# EAGLE design tester (EAGLE 5.10)
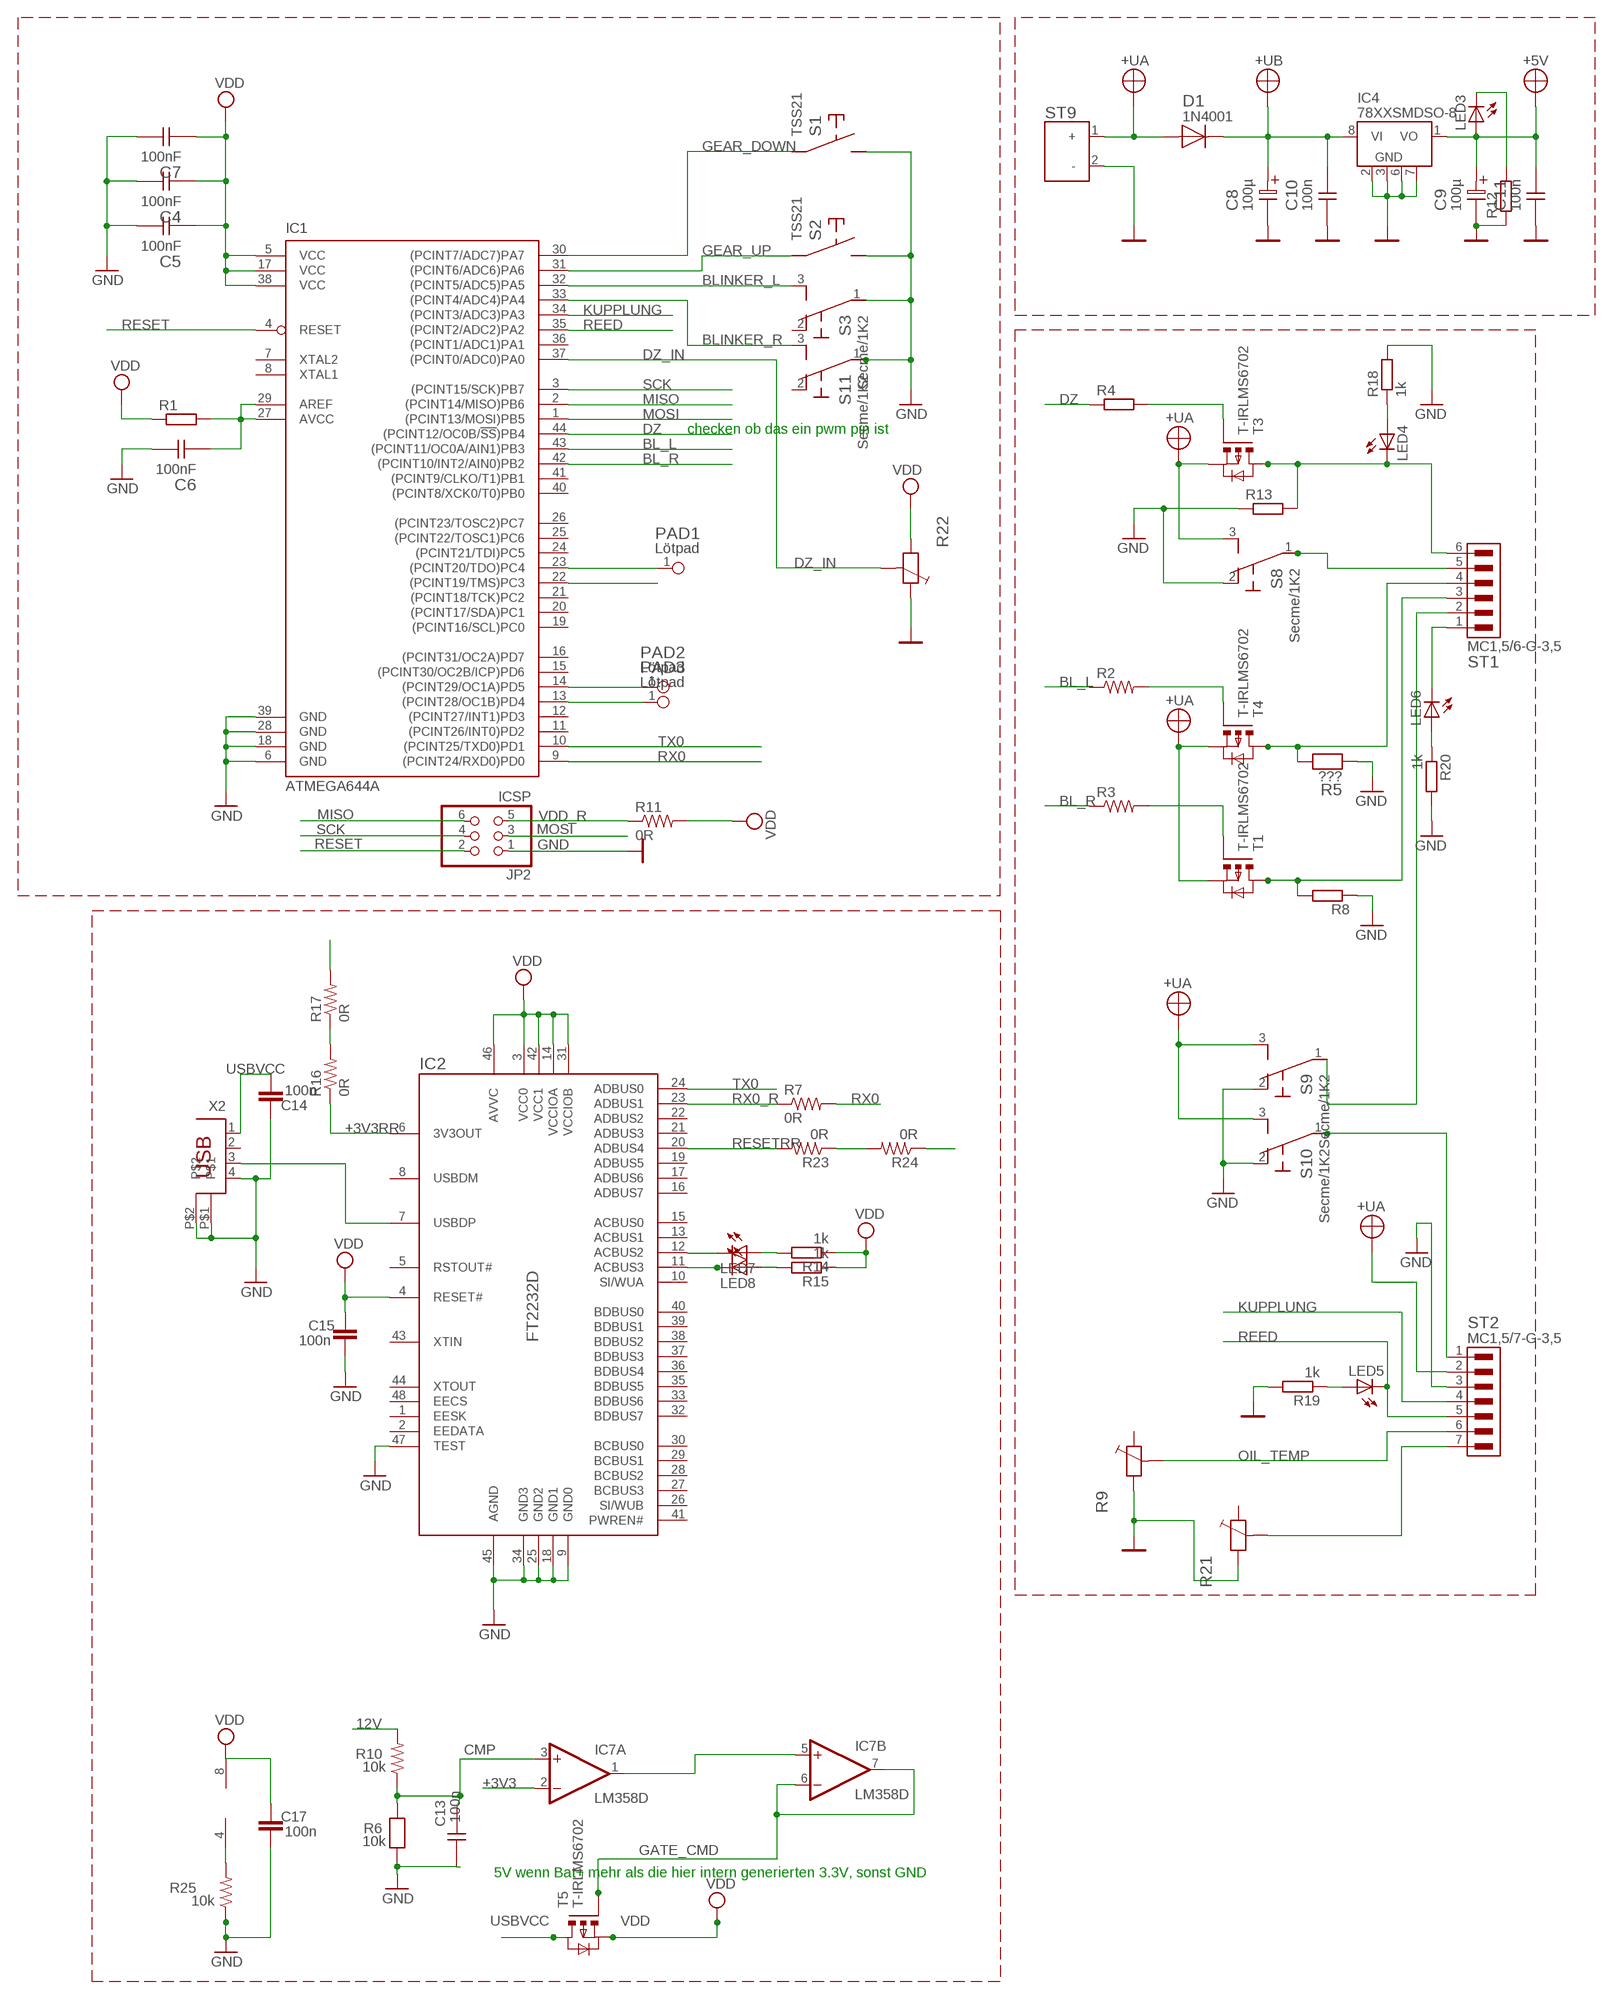
[diagram p0: schematic, sheet 1]

## Parts
C4  100nF  C0805  [0805]
C5  100nF  C0805  [0805]
C6  100nF  C0805  [0805]
C7  100nF  C0805  [0805]
C8  100µ  C-ELKO-SOCD  [CE-SOCD]
C9  100µ  C-ELKO-SOCD  [CE-SOCD]
C10  100n  C0805+0603  [0805+603]
C11  100n  C0805+0603  [0805+603]
C13  100n  WERT_/1206/1206/1206_CHIP-C  [1206]
C14  100n  C-EUC0805  [C0805]
C15  100n  C-EUC0805  [C0805]
C17  100n  C-EUC0805  [C0805]
D1  1N4001  D-MELF  [MELF]
IC1  ATMEGA644A  [TQFP44]
IC2  FT2232D  [LQFP-48]
IC4  78XXSMDSO-8  [SO-8]
IC7  LM358D  [SO08]
JP2  ICSP  PINHD-2X3  [2X03]
LED3  LEDCHIPLED_0805  [CHIPLED_0805]
LED4  LEDCHIPLED_0805  [CHIPLED_0805]
LED5  LEDCHIPLED_0805  [CHIPLED_0805]
LED6  LEDCHIPLED_0805  [CHIPLED_0805]
LED7  LEDCHIPLED_0805  [CHIPLED_0805]
LED8  LEDCHIPLED_0805  [CHIPLED_0805]
PAD1  PAD_01_2X4  [LP_2X4]
PAD2  PAD_01_2X4  [LP_2X4]
PAD3  PAD_01_2X4  [LP_2X4]
R1  R-EU_M0805  [M0805]
R2  RESISTOR1206  [1206]
R3  RESISTOR1206  [1206]
R4  R-EU_M0805  [M0805]
R5  0R  WERT_/0805/0805/0805  [0805]
R6  10k  WERT_/1206/1206/1206  [1206]
R7  0R  RESISTOR1206  [1206]
R8  R-EU_M0805  [M0805]
R9  R-TRIM-10-1,4-B  [PT-10-1,4-B]
R10  10k  RESISTOR1206  [1206]
R11  0R  RESISTOR1206  [1206]
R12  R-EU_M0805  [M0805]
R13  R-EU_M0805  [M0805]
R14  1k  R-EU_M0805  [M0805]
R15  1k  R-EU_M0805  [M0805]
R16  0R  RESISTOR1206  [1206]
R17  0R  RESISTOR1206  [1206]
R18  1k  R-EU_M0805  [M0805]
R19  1k  R-EU_M0805  [M0805]
R20  1k  R-EU_M0805  [M0805]
R21  R-TRIM-10-1,4-B  [PT-10-1,4-B]
R22  R-TRIM-10-1,4-B  [PT-10-1,4-B]
R23  0R  RESISTOR1206  [1206]
R24  0R  RESISTOR1206  [1206]
R25  10k  RESISTOR1206  [1206]
S1  TASTER_TSS21  [SW-KNITTER-TSS21]
S2  TASTER_TSS21  [SW-KNITTER-TSS21]
S3  SCHALTER_1XUM_1K2_1MM-BOHRUNG  [SW-1K2-10]
S8  SCHALTER_1XUM_1K2_1MM-BOHRUNG  [SW-1K2-10]
S9  SCHALTER_1XUM_1K2_1MM-BOHRUNG  [SW-1K2-10]
S10  SCHALTER_1XUM_1K2_1MM-BOHRUNG  [SW-1K2-10]
S11  SCHALTER_1XUM_1K2_1MM-BOHRUNG  [SW-1K2-10]
ST1  ST_06_MC_RM3,5  [MC1,5/6-G-3,5]
ST2  ST_07_MC_RM3,5  [MC1,5/7-G-3,5]
ST9  FRIWO  [FR-2-LP]
T1  T-IRLMS6702  [SOT-23-6]
T3  T-IRLMS6702  [SOT-23-6]
T4  T-IRLMS6702  [SOT-23-6]
T5  T-IRLMS6702  [SOT-23-6]
X2  PN61729  [PN61729]

## Nets
12V: D1.A R10.2 S8.3(NO) S9.3(NO) S10.3(NO) ST2.2 ST9.1(+) T1.4(S) T3.4(S) T4.4(S) ; supply symbol labelled +UA
+3V3 [power]: IC7.2(A:-IN) R17.2
+3V3RR [power]: IC2.6(3V3OUT) R16.1
+UB: C8.1 C10.2 D1.K IC4.8(VI)
BL_L: IC1.43((PCINT11/OC0A/AIN1)PB3) R2.1
BL_R: IC1.42((PCINT10/INT2/AIN0)PB2) R3.1
BLINKER_L: IC1.32((PCINT5/ADC5)PA5) S3.3(NO)
BLINKER_R: IC1.33((PCINT4/ADC4)PA4) S11.3(NO)
CMP: C13.2 IC7.3(A:+IN) R6.2 R10.1
DZ: IC1.44((PCINT12/OC0B/!SS!)PB4) R4.1
DZ_IN: IC1.37((PCINT0/ADC0)PA0) R22.3
GATE_CMD: IC7.6(B:-IN) IC7.7(B:OUT) T5.3(G)
GEAR_DOWN: IC1.30((PCINT7/ADC7)PA7) S1.1
GEAR_UP: IC1.31((PCINT6/ADC6)PA6) S2.1
GND: C4.2 C5.2 C6.2 C7.2 C8.2 C9.2 C10.1 C11.1 C13.1 C14.2 C15.1 C17.1 IC1.6(GND) IC1.18(GND) IC1.28(GND) IC1.39(GND) IC2.9(GND0) IC2.18(GND1) IC2.25(GND2) IC2.34(GND3) IC2.45(AGND) IC2.47(TEST) IC4.2 IC4.3 IC4.6 IC4.7 JP2.1 R5.1 R6.1 R8.1 R9.1 R12.1 R13.1 R18.2 R19.2 R20.2 R21.1 R22.2 R25.1 S1.2 S2.2 S3.1(C) S8.2(NC) S9.2(NC) S10.2(NC) S11.1(C) ST2.3 ST9.2(-) X2.4 X2.P$1 X2.P$2
KUPPLUNG: IC1.34((PCINT3/ADC3)PA3) ST2.4
MISO: IC1.2((PCINT14/MISO)PB6) JP2.6
MOSI: IC1.1((PCINT13/MOSI)PB5) JP2.3
N: S8.1(C) ST1.5
N$1: R21.3 ST2.7
N$2: LED7.A R14.2
N$3: S9.1(C) ST1.2
N$4: IC7.1(A:OUT) IC7.5(B:+IN)
N$5: C6.1 IC1.27(AVCC) IC1.29(AREF) R1.2
N$6: LED8.A R15.2
N$7: LED3.C R12.2
N$8: S10.1(C) ST2.1
N$9: R16.2 R17.1
N$10: IC1.22((PCINT19/TMS)PC3)
N$11: IC1.23((PCINT20/TDO)PC4) PAD1.1
N$12: R8.2 ST1.3 T1.1(D1) T1.2(D2) T1.5(D3) T1.6(D4)
N$13: R5.2 ST1.4 T4.1(D1) T4.2(D2) T4.5(D3) T4.6(D4)
N$14: R3.2 T1.3(G)
N$15: LED4.A R18.1
N$16: R2.2 T4.3(G)
N$17: LED4.C R13.2 ST1.6 T3.1(D1) T3.2(D2) T3.5(D3) T3.6(D4)
N$18: R4.2 T3.3(G)
N$19: LED5.A R19.1
N$20: R23.1 R24.2
N$21: IC7.4(P:V-) R25.2
N$22: LED6.A R20.1
N$23: IC2.12(ACBUS2) LED7.C
N$24: IC1.14((PCINT29/OC1A)PD5) PAD2.1
N$25: IC1.13((PCINT28/OC1B)PD4) PAD3.1
N$27: LED6.C ST1.1
N$29: IC2.11(ACBUS3) LED8.C
N$31: IC2.7(USBDP) X2.3
OIL_TEMP: R9.3 ST2.6
REED: IC1.35((PCINT2/ADC2)PA2) LED5.C ST2.5
RESET: IC1.4(RESET) JP2.2 R24.1
RESETRR: IC2.20(ADBUS4) R23.2
RX0: IC1.9((PCINT24/RXD0)PD0) R7.2
RX0_R: IC2.23(ADBUS1) R7.1
SCK: IC1.3((PCINT15/SCK)PB7) JP2.4
TX0: IC1.10((PCINT25/TXD0)PD1) IC2.24(ADBUS0)
USBVCC [usbvcc]: C14.1 T5.1(D1) T5.2(D2) T5.5(D3) T5.6(D4) X2.1
VDD: C4.1 C5.1 C7.1 C9.1 C11.2 C15.2 C17.2 IC1.5(VCC) IC1.17(VCC) IC1.38(VCC) IC2.3(VCC0) IC2.4(RESET#) IC2.14(VCCIOA) IC2.31(VCCIOB) IC2.42(VCC1) IC2.46(AVVC) IC4.1(VO) IC7.8(P:V+) LED3.A R1.1 R11.2 R14.1 R15.1 R22.1 T5.4(S) ; supply symbol labelled +5V
VDD_R: JP2.5 R11.1
Unconnected: IC1.7(XTAL2) IC1.8(XTAL1) IC1.11((PCINT26/INT0)PD2) IC1.12((PCINT27/INT1)PD3) IC1.15((PCINT30/OC2B/ICP)PD6) IC1.16((PCINT31/OC2A)PD7) IC1.19((PCINT16/SCL)PC0) IC1.20((PCINT17/SDA)PC1) IC1.21((PCINT18/TCK)PC2) IC1.24((PCINT21/TDI)PC5) IC1.25((PCINT22/TOSC1)PC6) IC1.26((PCINT23/TOSC2)PC7) IC1.36((PCINT1/ADC1)PA1) IC1.40((PCINT8/XCK0/T0)PB0) IC1.41((PCINT9/CLKO/T1)PB1) IC2.1(EESK) IC2.2(EEDATA) IC2.5(RSTOUT#) IC2.8(USBDM) IC2.10(SI/WUA) IC2.13(ACBUS1) IC2.15(ACBUS0) IC2.16(ADBUS7) IC2.17(ADBUS6) IC2.19(ADBUS5) IC2.21(ADBUS3) IC2.22(ADBUS2) IC2.26(SI/WUB) IC2.27(BCBUS3) IC2.28(BCBUS2) IC2.29(BCBUS1) IC2.30(BCBUS0) IC2.32(BDBUS7) IC2.33(BDBUS6) IC2.35(BDBUS5) IC2.36(BDBUS4) IC2.37(BDBUS3) IC2.38(BDBUS2) IC2.39(BDBUS1) IC2.40(BDBUS0) IC2.41(PWREN#) IC2.43(XTIN) IC2.44(XTOUT) IC2.48(EECS) R9.2 R21.2 S3.2(NC) S11.2(NC) X2.2

## Notes on the sheet
- checken ob das ein pwm pin ist
- 5V wenn Bat+ mehr als die hier intern generierten 3.3V, sonst GND

## Library data of the parts
C4-C7 C10 C11 = RCLDT:C
C8 C9 = RCLDT:C-ELKO
C13 = C:WERT_???_CHIP-C: ohne Artikelnummer; ARTIKELNUMMER: ?; PACKAGE: 1206; WERT: ???
C14 C15 C17 = resistor:C-EU: CAPACITOR, European symbol
D1 = RCLDT:D
IC1 = atmel:ATMEGA644: 8-bit Microcontroller with 64K Bytes In-System Programmable Flash Source: http://www.atmel.com/dyn/resources/prod_documents/doc2593.pdf; MPN: ATMEGA644PV-10AU; OC_FARNELL: 1455123; OC_NEWARK: 58M3748
IC2 = Digital:FT2232D: Dual USB to serial UART/FIFO Features Single chip USB <=> dual channel serial/parallel ports with a variety of configurations Entire USB protocol handled on the chip: no USB-specific firmware programming required FT232B-style UART interface option with full handshaking & modem interface signals UART interface supports 7/8 data bits, 1/2 stop bits and Odd/Even/Mark/Space/No Parity Data transfer rate of 300 Baud => 1M Baud (RS232) Data transfer rate of 300 Baud => 3M Baud (TTL and RS422/RS485) Auto transmit enable control for RS485 serial applications using TXDEN pin In-built support for event characters and line break condition Transmit and receive LED drive signals on each channel FT245B-style FIFO interface option with bi-directional data bus and simple 4-wire handshaking interface Data transfer rate up to 1M Byte/second (Parallel FIFO) Enhanced Bit-Bang Mode interface option with RD# and WR# strobes New Synchronous Bit-Bang Mode interface option New Multi-Protocol Synchronous Serial Engine (MPSSE) interface option New CPU-style FIFO interface mode option (FT2232D only) New MCU Host Bus Emulation Mode option New Fast Opto-Isolated Serial Interface Mode option High I/O pin output drive option Interface mode and USB description strings configurable in external EEPROM EEPROM configurable on-board via USB Support for USB suspend and resume conditions via PWREN# and SI/WU pins Support for bus powered, self powered and high-power bus powered USB configurations Integrated Power-On-Reset circuit with optional reset input and reset output pins 5V and 3.3V logic IO interfacing with independent level conversion on each channel Integrated 3.3V LDO regulator for USB IO Integrated 6MHz - 48Mhz clock multiplier PLL USB Bulk data transfer modes 4.35V to 5.25V single supply operating voltage range Low operating and USB suspend current UHCI/OHCI/EHCI host controller compatible USB 2.0 Full Speed (12M bits/second) compatible Extended -40°C to 85°C industrial operating temperature range (FT2232D only) Compact 48-LD lead free LQFP package (RoHS compliant) FTDI?s royalty-free VCP <../../Drivers/VCP.htm> and D2XX <../../Drivers/D2XX.htm> drivers eliminate the requirement for USB driver development in most cases Dedicated Windows DLLs available for USB to JTAG <../../Support/SoftwareExamples/MPSSE/FTCJTAG.htm>, USB to SPI <../../Support/SoftwareExamples/MPSSE/FTCSPI.htm> and USB to I2C <../../Support/SoftwareExamples/MPSSE/FTCI2C.htm> applications; ARTIKELNUMMER: 680637; HERSTELLER: FTDI; PACKAGE: LQFP48; WERT: FT2232D
IC4 = linear:78XXSMD
IC7 = linear:LM358: OP AMP also LM158; LM258; LM2904 Source: http://cache.national.com/ds/LM/LM158.pdf
JP2 = pinhead:PINHD-2X3: PIN HEADER
LED3-LED8 = led:LED: LED OSRAM: - CHIPLED LG R971, LG N971, LY N971, LG Q971, LY Q971, LO R971, LY R971 LH N974, LH R974 LS Q976, LO Q976, LY Q976 LO Q996 - Hyper CHIPLED LW Q18S LB Q993, LB Q99A, LB R99A - SideLED LS A670, LO A670, LY A670, LG A670, LP A670 LB A673, LV A673, LT A673, LW A673 LH A674 LY A675 LS A676, LA A676, LO A676, LY A676, LW A676 LS A679, LY A679, LG A679 - Hyper Micro SIDELED® LS Y876, LA Y876, LO Y876, LY Y876 LT Y87S - SmartLED LW L88C, LW L88S LB L89C, LB L89S, LG L890 LS L89K, LO L89K, LY L89K LS L896, LA L896, LO L896, LY L896 - TOPLED LS T670, LO T670, LY T670, LG T670, LP T670 LSG T670, LSP T670, LSY T670, LOP T670, LYG T670 LG T671, LOG T671, LSG T671 LB T673, LV T673, LT T673, LW T673 LH T674 LS T676, LA T676, LO T676, LY T676, LB T676, LH T676, LSB T676, LW T676 LB T67C, LV T67C, LT T67C, LS T67K, LO T67K, LY T67K, LW E67C LS E67B, LA E67B, LO E67B, LY E67B, LB E67C, LV E67C, LT E67C LW T67C LS T679, LY T679, LG T679 LS T770, LO T770, LY T770, LG T770, LP T770 LB T773, LV T773, LT T773, LW T773 LH T774 LS E675, LA E675, LY E675, LS T675 LS T776, LA T776, LO T776, LY T776, LB T776 LHGB T686 LT T68C, LB T68C - Hyper Mini TOPLED® LB M676 - Mini TOPLED Santana® LG M470 LS M47K, LO M47K, LY M47K Source: http://www.osram.convergy.de LUXEON: - LUMILED® LXK2-PW12-R00, LXK2-PW12-S00, LXK2-PW14-U00, LXK2-PW14-V00 LXK2-PM12-R00, LXK2-PM12-S00, LXK2-PM14-U00 LXK2-PE12-Q00, LXK2-PE12-R00, LXK2-PE12-S00, LXK2-PE14-T00, LXK2-PE14-U00 LXK2-PB12-K00, LXK2-PB12-L00, LXK2-PB12-M00, LXK2-PB14-N00, LXK2-PB14-P00, LXK2-PB14-Q00 LXK2-PR12-L00, LXK2-PR12-M00, LXK2-PR14-Q00, LXK2-PR14-R00 LXK2-PD12-Q00, LXK2-PD12-R00, LXK2-PD12-S00 LXK2-PH12-R00, LXK2-PH12-S00 LXK2-PL12-P00, LXK2-PL12-Q00, LXK2-PL12-R00 Source: www.luxeon.com KINGBRIGHT: KA-3528ASYC Source: www.kingbright.com
PAD1-PAD3 = Spezial:PAD_01: Lötpads; PACKAGE: Lötpad; WERT: Lötpad
R1 = rcl:R-EU_: RESISTOR, European symbol
R2 R3 R7 R10 R11 R16 R17 R23-R25 = SparkFun:RESISTOR: Resistor Basic schematic elements and footprints for 0603, 1206, and PTH resistors.
R4 R8 R12-R15 R18-R20 = resistor:R-EU_: RESISTOR, European symbol
R5 = R:WERT_???: ohne Artikelnummer!; ARTIKELNUMMER: ?; PACKAGE: 0805; WERT: ???
R6 = R:WERT_???: ohne Artikelnummer!; ARTIKELNUMMER: ?; PACKAGE: 1206; WERT: ???
R9 R21 R22 = RCLDT:R-TRIM
S1 S2 = Schalter+Relais:TASTER: Taster; ARTIKELNUMMER: 131086; HERSTELLER: Knitter TSS21-N; PACKAGE: THT; SPANNUNG: max 12V; STROM: max 50mA; WERT: TSS21
S3 S8-S11 = Schalter+Relais:SCHALTER_1XUM: Umschalter 1polig; ARTIKELNUMMER: 131013; BESONDERHEITEN: 1000 Betätigungen; HERSTELLER: Secme 1K2 09 03201 02; LEISTUNG: 6W; PACKAGE: THT; SPANNUNG: 12V, max 24V; STROM: 500mA; WERT: Secme/1K2
ST1 = Stecker:ST_06: Stecker; ARTIKELNUMMER: 154031; BESONDERHEITEN: Stecker 155130; HERSTELLER: Phönix 1844252; PACKAGE: THT; RM: 3,5; SPANNUNG: 160V; STROM: 8A; WERT: MC1,5/6-G-3,5
ST2 = Stecker:ST_07: Stecker; ARTIKELNUMMER: 154153; BESONDERHEITEN: Stecker 155132; HERSTELLER: Phönix 1844265; PACKAGE: THT; RM: 3,5; SPANNUNG: 160V; STROM: 8A; WERT: MC1,5/7-G-3,5
ST9 = CONNECT:FRIWO
T1 T3-T5 = RCLDT:T-IRLMS6702
X2 = SmartPrj:PN61729: BERG USB connector

## Net classes
1 power: width 0.61 mm, drill 0.711 mm, clearance 0.203 mm
3 usbvcc: width 0.508 mm, drill 0.711 mm, clearance 0.203 mm

## Board
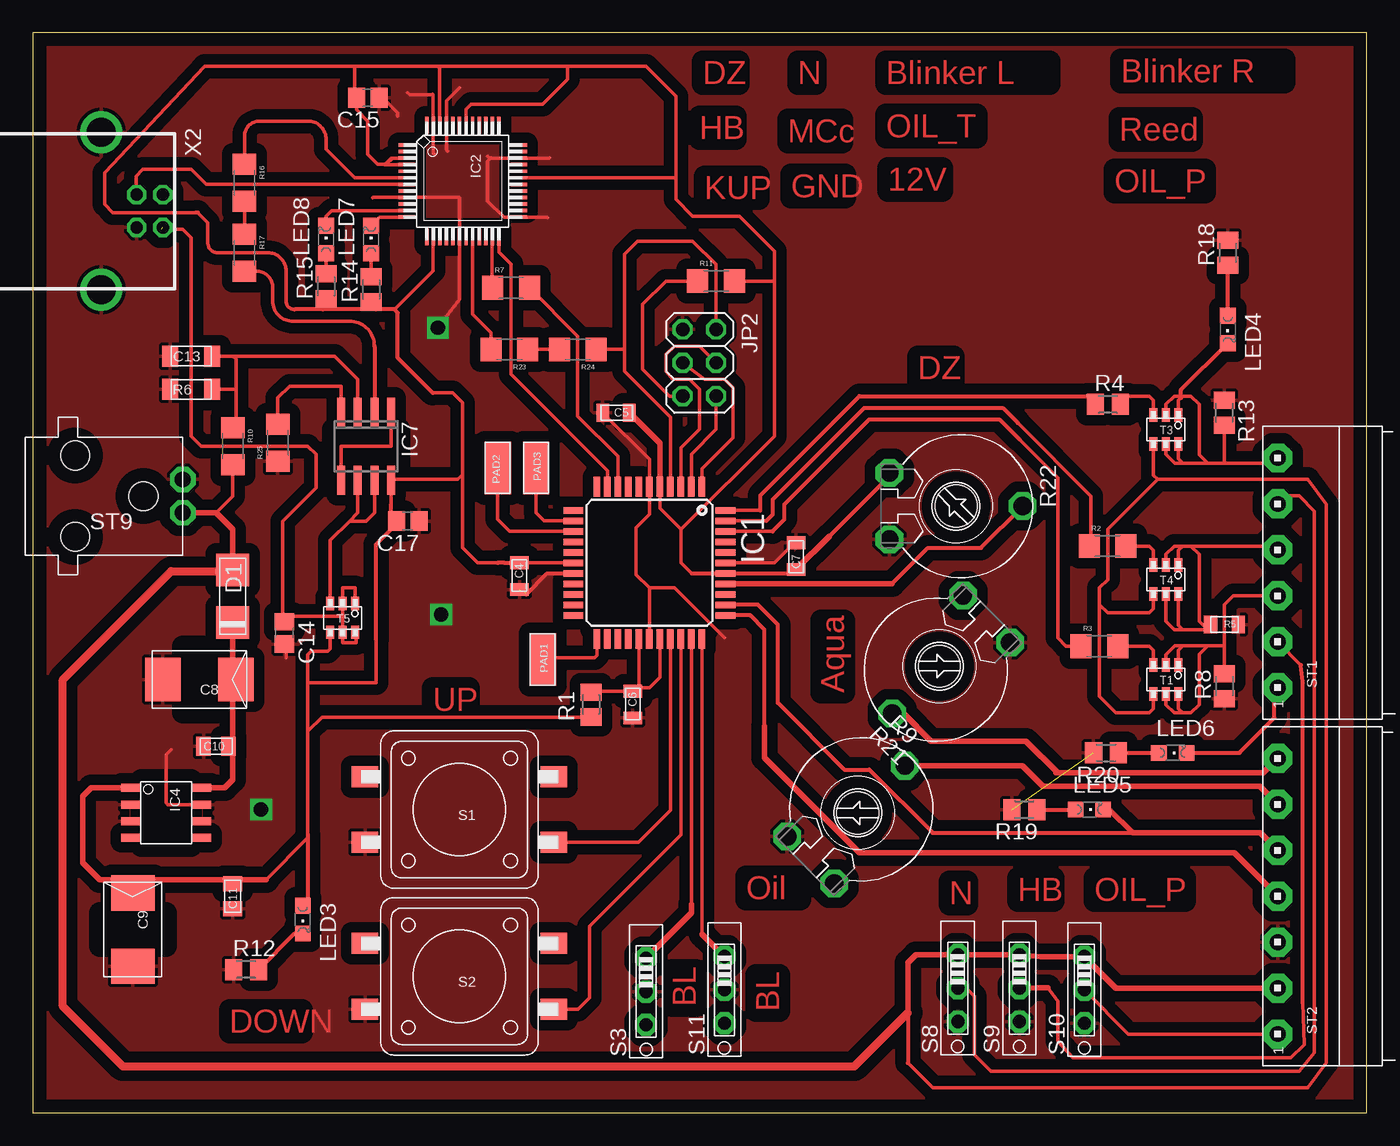
[diagram p1: board, top side]
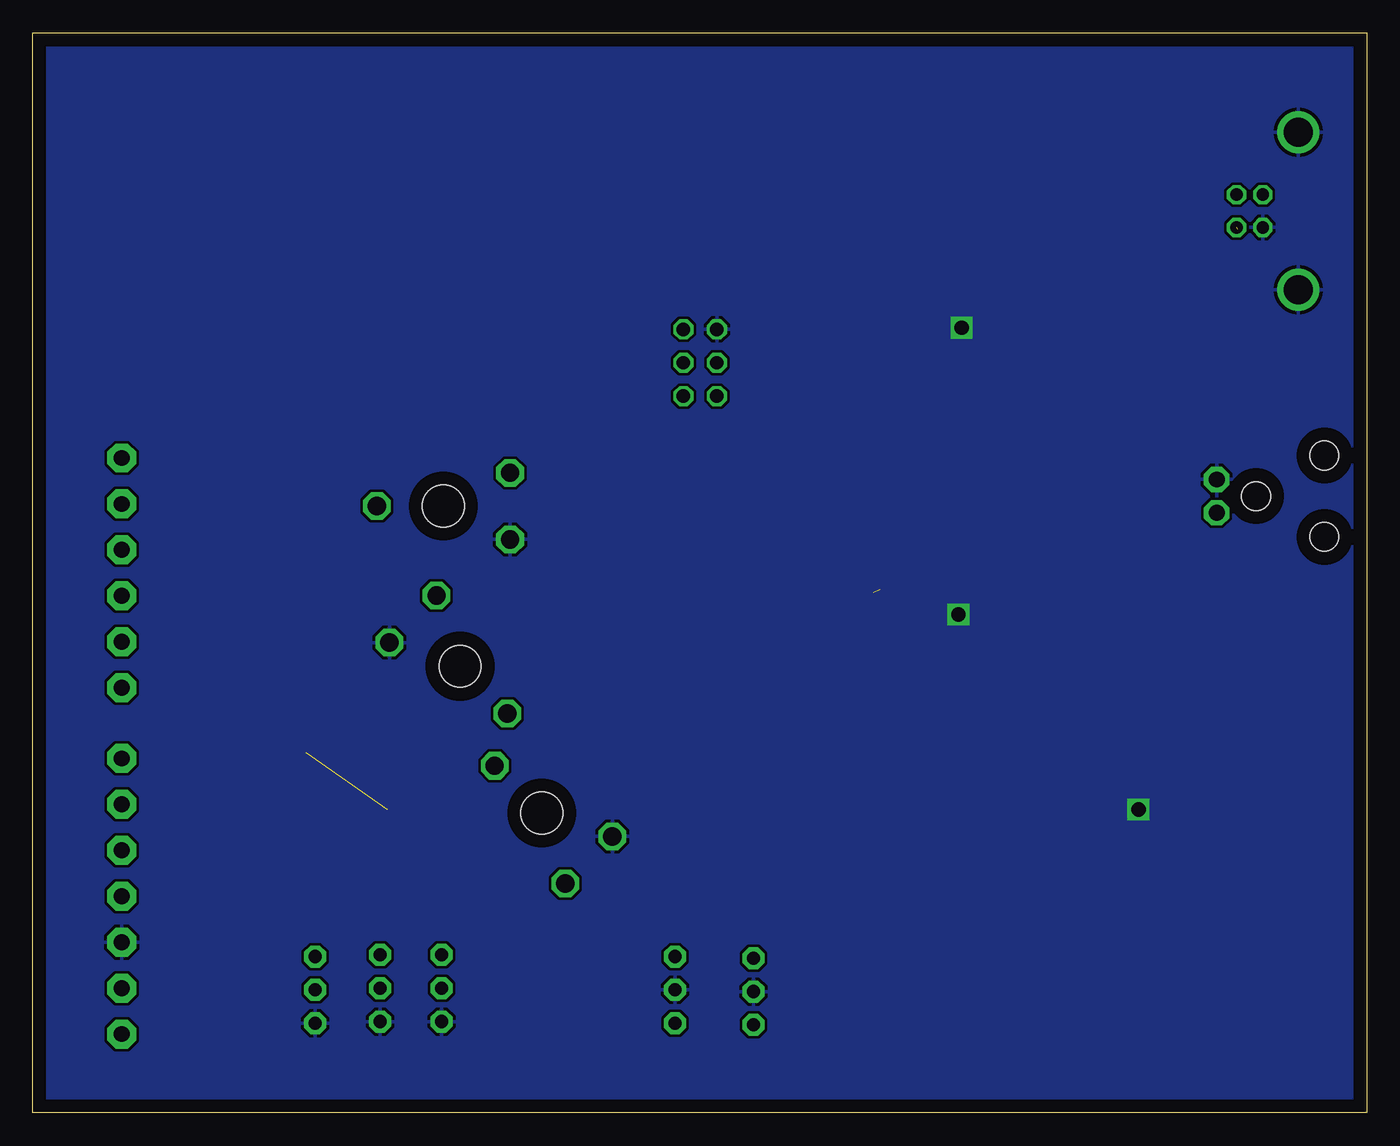
[diagram p2: board, bottom side, seen from below]

Size 101.65 x 82.29 mm. Coordinates in mm from the lower left corner, seen from the top.
Outline: 0,0 101.65,0 101.65,82.29 0,82.29 0,0
Copper layers (1*16): Top 0.035mm / dielectric 1.5mm / Bottom 0.035mm
Design rules "default": minimum track width 10mil, minimum drill 24mil, track to track 8mil, track to pad 8mil, pad to pad 8mil, via to via 8mil, smd to smd 8mil, copper to edge 40mil, drill to drill 8mil, minimum pad ring 10mil, minimum via ring 8mil, stop-mask expansion 4mil, vias tented up to drill 0mil, thermal gap 10mil
tRestrict: area 8.3,20.3 to 12.1,25.4; area 11.4,30.5 to 14,35.6; area 42.5,36.8 to 51.4,46.4; area 22.9,49.5 to 27.9,52.1; area 5.1,12.7 to 10.2,15.2

### Footprints (pad centres in the part's own frame; a part is rotated, then mirrored left to right if it is on the bottom)
0805 = smd 0.965 x 1.397: 1 -1.016,0; 2 1.016,0
CE-SOCD = smd 2.7 x 3.3: 1 -2.794,0; 2 2.794,0
0805+603 = smd 1.11 x 1.43: 1 -0.953,0; 2 0.953,0
1206 = smd 1.2 x 1.6: 1 -1.6,0; 2 1.6,0
C0805 = smd 1.3 x 1.5: 1 -0.85,0; 2 0.85,0
MELF = smd 2.5 x 2.5: A -2,0; K 2,0
TQFP44 = smd 1.5 x 0.5: 1 -5.8,4; 2 -5.8,3.2; 3 -5.8,2.4; 4 -5.8,1.6; 5 -5.8,0.8; 6 -5.8,0; 7 -5.8,-0.8; 8 -5.8,-1.6; 9 -5.8,-2.4; 10 -5.8,-3.2; 11 -5.8,-4; 23 5.8,-4; 24 5.8,-3.2; 25 5.8,-2.4; 26 5.8,-1.6; 27 5.8,-0.8; 28 5.8,0; 29 5.8,0.8; 30 5.8,1.6; 31 5.8,2.4; 32 5.8,3.2; 33 5.8,4 | smd 0.5 x 1.5: 12 -4,-5.8; 13 -3.2,-5.8; 14 -2.4,-5.8; 15 -1.6,-5.8; 16 -0.8,-5.8; 17 0,-5.8; 18 0.8,-5.8; 19 1.6,-5.8; 20 2.4,-5.8; 21 3.2,-5.8; 22 4,-5.8; 34 4,5.8; 35 3.2,5.8; 36 2.4,5.8; 37 1.6,5.8; 38 0.8,5.8; 39 0,5.8; 40 -0.8,5.8; 41 -1.6,5.8; 42 -2.4,5.8; 43 -3.2,5.8; 44 -4,5.8
LQFP-48 = smd 0.254 x 1.27: 1 -2.75,-4.25; 2 -2.25,-4.25; 3 -1.75,-4.25; 4 -1.25,-4.25; 5 -0.75,-4.25; 6 -0.25,-4.25; 7 0.25,-4.25; 8 0.75,-4.25; 9 1.25,-4.25; 10 1.75,-4.25; 11 2.25,-4.25; 12 2.75,-4.25; 25 2.75,4.25; 26 2.25,4.25; 27 1.75,4.25; 28 1.25,4.25; 29 0.75,4.25; 30 0.25,4.25; 31 -0.25,4.25; 32 -0.75,4.25; 33 -1.25,4.25; 34 -1.75,4.25; 35 -2.25,4.25; 36 -2.75,4.25 | smd 1.27 x 0.254: 13 4.25,-2.75; 14 4.25,-2.25; 15 4.25,-1.75; 16 4.25,-1.25; 17 4.25,-0.75; 18 4.25,-0.25; 19 4.25,0.25; 20 4.25,0.75; 21 4.25,1.25; 22 4.25,1.75; 23 4.25,2.25; 24 4.25,2.75; 37 -4.25,2.75; 38 -4.25,2.25; 39 -4.25,1.75; 40 -4.25,1.25; 41 -4.25,0.75; 42 -4.25,0.25; 43 -4.25,-0.25; 44 -4.25,-0.75; 45 -4.25,-1.25; 46 -4.25,-1.75; 47 -4.25,-2.25; 48 -4.25,-2.75
SO-8 = smd 0.61 x 1.524: 1 -1.905,-2.661; 2 -0.635,-2.661; 3 0.635,-2.661; 4 1.905,-2.661; 5 1.905,2.661; 6 0.635,2.661; 7 -0.635,2.661; 8 -1.905,2.661
SO08 = smd 0.6 x 2.2: 1 -1.905,-2.6; 2 -0.635,-2.6; 3 0.635,-2.6; 4 1.905,-2.6; 5 1.905,2.6; 6 0.635,2.6; 7 -0.635,2.6; 8 -1.905,2.6
2X03 = drill 1.016 octagon: 1 -2.54,-1.27; 2 -2.54,1.27; 3 0,-1.27; 4 0,1.27; 5 2.54,-1.27; 6 2.54,1.27
CHIPLED_0805 = smd 1.2 x 1.2: A 0,-1.05; C 0,1.05
LP_2X4 = smd 4 x 2: 1 0,0
M0805 = smd 1.3 x 1.6: 1 -0.95,0; 2 0.95,0
1206' = smd 1.6 x 1.8: 1 -1.4,0; 2 1.4,0
0805' = smd 1 x 1.3: 1 -1.05,0; 2 1.05,0
PT-10-1,4-B = drill 1.4 pad 1.778 octagon: 1 -2.54,-5.08; 2 2.54,-5.08; 3 0,5.08 | hole 3.2: 0,0
SW-KNITTER-TSS21 = smd 2 x 1.6: 1 -7.2,2.5; 2 7.2,2.5; 3 -7.2,-2.5; 4 7.2,-2.5
SW-1K2-10 = drill 1 pad 1.676 octagon: 1 -0.02,0; 2 -2.56,0; 3 2.52,0
MC1,5/6-G-3,5 = drill 1.2 pad 2.2 octagon: 1 -8.75,0; 2 -5.25,0; 3 -1.75,0; 4 1.75,0; 5 5.25,0; 6 8.75,0
MC1,5/7-G-3,5 = drill 1.2 pad 2.2 octagon: 1 -10.5,0; 2 -7,0; 3 -3.5,0; 4 0,0; 5 3.5,0; 6 7,0; 7 10.5,0
FR-2-LP = drill 1.2 pad 1.93 octagon: 1 0,1.27; 2 0,-1.27 | hole 2.2: 3,0; 8.2,3.1; 8.2,-3.1
SOT-23-6 = smd 0.61 x 1.016: 1 -0.95,-1.1; 2 0,-1.1; 3 0.95,-1.1; 4 0.95,1.1; 5 0,1.1; 6 -0.95,1.1
PN61729 = drill 0.95 octagon: 1 1.25,4.71; 2 -1.25,4.71; 3 -1.25,2.71; 4 1.25,2.71 | drill 2.2 round: P$1 -6,0; P$2 6,0

### Placement (x,y rotation side)
C4  37.08,40.89 270 top
C5  44.45,53.34 180 top
C6  45.72,31.11 270 top
C7  58.17,42.42 90 top
C8  12.7,33.02 180 top
C9  7.62,13.97 270 top
C10  13.97,27.94 0 top
C11  15.24,16.51 90 top
C13  12.06,57.66 0 top
C14  19.18,36.58 270 top
C15  25.53,77.34 180 top
C17  28.57,45.09 180 top
D1  15.24,39.37 270 top
IC1  46.99,41.91 270 top
IC2  32.77,70.99 270 top
IC4  10.16,22.86 270 top
IC7  25.4,50.8 180 top
JP2  50.8,57.15 270 top
LED3  20.57,14.73 180 top
LED4  91.06,59.69 180 top
LED5  80.52,23.11 270 top
LED6  86.87,27.43 270 top
LED7  25.78,66.55 0 top
LED8  22.35,66.55 0 top
PAD1  38.86,34.54 90 top
PAD2  35.43,49.15 270 top
PAD3  38.35,49.15 90 top
R1  42.55,31.11 90 top
R2  [1206']  81.92,43.18 0 top
R3  [1206']  81.28,35.56 0 top
R4  81.92,53.98 0 top
R5  0R  [0805']  90.81,37.21 180 top
R6  12.06,55.12 0 top
R7  0R  [1206']  36.45,62.87 0 top
R8  90.81,32.51 90 top
R9  62.87,22.86 315 top
R10  10k  [1206']  15.24,50.8 270 top
R11  0R  [1206']  52.07,63.37 0 top
R12  16.26,10.92 0 top
R13  90.81,53.34 270 top
R14  25.78,62.74 90 top
R15  22.35,62.99 90 top
R16  0R  [1206']  16.13,70.87 270 top
R17  0R  [1206']  16.13,65.53 270 top
R18  91.06,65.53 90 top
R19  75.56,23.11 180 top
R20  81.79,27.43 180 top
R21  69.09,34.04 135 top
R22  70.36,46.23 270 top
R23  0R  [1206']  36.32,58.17 180 top
R24  0R  [1206']  41.53,58.17 180 top
R25  10k  [1206']  18.67,51.05 90 top
S1  32.51,23.11 180 top
S2  32.51,10.41 180 top
S3  46.74,9.27 90 top
S8  70.48,9.53 90 top
S9  75.18,9.53 90 top
S10  80.14,9.4 90 top
S11  52.7,9.4 90 top
ST1  94.87,41.15 90 top
ST2  94.87,16.51 90 top
ST9  11.43,46.99 180 top
T1  86.36,33.02 180 top
T3  86.36,52.07 180 top
T4  86.36,40.64 180 top
T5  23.62,37.72 180 top
X2  5.21,68.71 270 top

### Tracks (layer width: path | path; a pad name or v marks a point on that pad's centre or on a via)
12V
  Top 0.254: T1.4 85.41,30.8 85.09,30.48 82.55,30.48 81.28,31.75 81.28,38.73 | 81.28,38.73 81.28,40.01 81.92,40.64 81.92,44.45 85.72,48.26 | 85.72,48.26 97.16,48.26 98.55,46.35 98.55,3.81 97.16,1.91 68.58,1.91 66.67,3.81 | T3.4 85.41,48.58 85.72,48.26 | T4.4 85.41,38.42 85.09,38.1 81.92,38.1 81.28,38.73 | 13.97,45.72 15.24,46.99 R10.2
  Top 0.305: 66.67,3.81 66.67,7.49 66.61,7.56 | D1.A 14.83,41.37 14.73,41.27
  Top 0.406: D1.A 15.24,44.45 13.97,45.72 ST9.1 | 66.67,7.62 66.67,11.43 67.29,12.04 S8.3 S9.3 76.83,11.92 S10.3 82.55,9.51 ST2.2
  Top 0.61: 15.88,41.27 14.73,41.27 10.54,41.27 2.29,33.02 2.29,8.13 6.86,3.56 62.61,3.56 66.61,7.56 66.67,7.62
+3V3
  Top 0.254: R17.2 17.02,64.13 arc-90 18.29,62.87 18.29,61.85 arc90 19.81,60.33 24.13,60.33 arc-90 26.04,58.42
  Top 0.305: 26.04,58.42 IC7.2
+3V3RR
  Top 0.254: R16.1 16.13,74.42 arc-90 17.27,75.56 20.95,75.56 arc-90 22.35,74.17 22.35,73.41 24.52,71.24 IC2.6
+UB
  Top 0.406: 15.24,33.02 D1.K | 15.24,33.02 C8.1 15.24,32.77 15.24,27.94 | 15.24,33.02 14.92,32.7 | IC4.8 14.61,24.77 15.24,25.4 15.24,27.94 | 15.24,27.94 C10.2
BL_L
  Top 0.254: IC1.43 55.91,45.11 | R2.1 80.64,43.5 80.64,46.99 75.06,52.58
  Top 0.305: 55.91,45.11 56.39,45.59 56.39,46.74 63.37,53.72 73.91,53.72 75.06,52.58
BL_R
  Top 0.254: IC1.42 56.38,44.31 | R3.1 78.74,35.56 78.11,36.2 78.11,48.39 75.18,51.31
  Top 0.305: 56.38,44.31 57.28,45.21 57.28,46.35 63.75,52.83 73.66,52.83 75.18,51.31
BLINKER_L
  Top 0.254: 50.19,15.9 IC1.32
  Top 0.406: 50.19,15.9 50.19,15.24 S3.3
BLINKER_R
  Top 0.254: 50.99,13.63 IC1.33
  Top 0.406: S11.3 51.23,13.39 50.99,13.63
CMP
  Top 0.254: IC7.3 24.77,55.88 22.99,57.66 15.24,57.66 | R10.1 15.49,52.2 15.49,55.12 | 15.24,57.66 15.11,57.66 C13.2 | 15.24,57.66 15.49,57.4 15.49,55.12 | R6.2 15.49,55.12
DZ
  Top 0.254: IC1.44 55.44,45.91
  Top 0.305: 55.44,45.91 55.44,47.05 62.99,54.61 80.33,54.61 R4.1
DZ_IN
  Top 0.305: 65.48,40.31 68.22,43.05 72.26,43.05 R22.3
  Top 0.406: IC1.37 65.48,40.31
GATE_CMD
  Top 0.254: 24.13,45.09 24.77,45.72 IC7.6 | IC7.7 26.04,45.72 25.4,45.09 24.13,45.09 | T5.3 22.67,43.63 24.13,45.09
GEAR_DOWN
  Top 0.254: IC1.30 48.59,23.06 46.14,20.61 S1.1
GEAR_UP
  Top 0.254: S2.1 41.57,7.91 42.42,8.76 42.42,14.22 49.39,21.2 IC1.31
GND  (via drill 1.1)  (2 unrouted)
  Top 0.254: IC1.39 56.52,41.91 57.78,43.18 C7.2 | IC1.28 46.99,40.01 | 46.99,40.01 48.9,40.01 52.7,36.2 | C5.2 46.99,49.78 IC1.6 46.99,45.59 45.97,44.58 45.97,41.02 46.99,40.01 | IC4.7 10.29,23.5 10.16,23.62 10.16,27.3 10.54,27.69 | v30.86,59.82 32.52,61.98 IC2.18 32.51,69.72 32.49,69.74 IC2.9 25.93,69.74 25.91,69.72 | 30.52,77.56 IC2.47 30.52,73.12 30.61,73.03 | 30.52,77.56 30.48,77.6 | 39.37,72.77 39.34,72.74 IC2.34 34.83,72.74 34.67,72.9 | 39.24,68.2 39.2,68.24 IC2.25 35.9,68.24 34.67,69.47 34.67,72.52 34.92,72.77 | 32.51,78.11 31.52,77.11 IC2.45 31.52,73.39 31.62,73.28 | 30.52,77.56 28.74,77.56 28.57,77.72 | 19.09,35.81 C14.2 | 19.09,35.81 19.05,35.81 | 19.09,35.81 19.18,35.81 19.3,35.69 19.3,34.67 | C15.1 26.5,77.47 26.54,77.47 27.81,76.2 27.81,75.95 | R25.1 18.67,49.02
  Top 0.305: IC1.18 39.2,41.11 37.59,39.5 37.59,39.62
  other vias: 31.11,37.97 17.4,23.11
  pour Top (isolate 0.813): 0.64,81.79 100.97,81.79 101.6,0.64 0.64,0.64
  pour Bottom: 1.02,0.89 101.35,1.14 101.09,81.28 1.02,81.28 0.64,1.27
KUPPLUNG
  Top 0.305: IC1.34 54.67,37.91 55.75,36.83 55.75,29.46
  Top 0.406: ST2.4 91.57,19.81 62.99,19.81 55.75,27.05 55.75,29.46
MISO
  Top 0.254: IC1.2 50.19,50.19 52.07,52.07 JP2.6
MOSI
  Top 0.254: IC1.1 50.99,49.09 53.34,51.44 53.34,55.24 52.7,55.88 51.18,55.88 JP2.3
N
  Top 0.254: 71.12,9.53 71.75,8.89 71.75,4.45 73.03,3.17 96.52,3.17 97.66,4.57 97.66,45.85 96.5,47.01 95.48,47.01 ST1.5
  Top 0.406: S8.1 71.12,9.51 71.12,9.53
N$1
  Top 0.406: 78.11,25.91 77.98,25.91 | 78.11,25.91 93.77,25.91 ST2.7 | R21.3 66.33,30.44 68.45,28.32 75.69,28.32 78.11,25.91
N$2
  Top 0.254: R14.2 LED7.A
N$3
  Top 0.254: 77.34,9.53 78.11,8.51 78.11,5.46 79.25,4.19 95.89,4.19 96.9,5.21 96.77,8.38 | 96.65,34.12 ST1.2
  Top 0.305: 96.65,34.12 96.77,32.85 96.77,8.38
  Top 0.406: 77.34,9.53 76.58,9.53 S9.1
N$4
  Top 0.254: IC7.5 23.5,50.8 27.3,50.8 IC7.1
N$5
  Top 0.254: IC1.29 47.79,33.19 46.99,32.38 45.97,32.38 C6.1 | C6.1 42.61,32.13 R1.2 | IC1.27 46.19,32.6 C6.1
N$6
  Top 0.254: R15.2 LED8.A
N$7
  Top 0.305: R12.2 19.97,13.68 LED3.C
N$8
  Top 0.254: S10.1 83.5,6.01 ST2.1
N$9
  Top 0.254: R17.1 R16.2
N$11
  Top 0.254: IC1.23 42.99,34.86 42.8,34.67 38.99,34.67 PAD1.1
N$12
  Top 0.254: 87.63,35.58 87.02,35.58 86.36,34.92 T1.2 | 89.53,35.58 87.63,35.58 | 89.53,35.58 90.81,35.58 | T1.1 87.31,35.26 87.63,35.58 | T1.6 87.31,30.8 87.63,30.48 | 87.63,30.48 88.27,30.48 88.9,31.11 88.9,34.95 89.53,35.58 | T1.5 86.36,31.11 87,30.48 87.63,30.48 | 90.81,35.58 R8.2 | 90.81,35.58 90.81,38.73 91.47,39.4 ST1.3
N$13
  Top 0.254: T4.6 87.31,37.15 87.63,36.83 | 87.63,36.83 89.53,36.83 | T4.5 86.36,37.47 87,36.83 87.63,36.83 | T4.1 87.31,42.86 87.63,43.18 | 88.27,43.18 87.63,43.18 | T4.2 86.36,42.55 87,43.18 87.63,43.18 | 88.27,43.18 88.9,42.55 88.9,37.47 89.53,36.83 | ST1.4 94.59,43.18 88.27,43.18 | R5.2 89.53,36.89 89.53,36.83
N$14
  Top 0.254: T1.3 85.41,35.24 85.09,35.56 R3.2
N$15
  Top 0.305: LED4.A R18.1
N$16
  Top 0.254: T4.3 85.41,42.86 85.09,43.18 R2.2
N$17
  Top 0.254: 87.63,49.51 87.02,49.51 86.36,50.16 T3.5 | 87.63,49.51 89.53,49.51 | 89.53,49.51 90.81,49.51 | T3.6 87.31,49.83 87.63,49.51 | T3.2 86.36,53.98 87,54.61 87.63,54.61 | T3.1 87.31,54.29 87.5,54.48 87.63,54.61 | 87.63,54.61 88.27,54.61 88.9,53.98 88.9,50.15 89.53,49.51 | 90.81,49.51 R13.2 | ST1.6 94.48,49.51 90.81,49.51
  Top 0.305: LED4.C 87.5,55.08 87.5,54.48
N$18
  Top 0.254: T3.3 85.41,54.29 85.09,54.61 83.5,54.61 R4.2
N$19
  Top 0.305: R19.1 LED5.A
N$20
  Top 0.254: R23.1 R24.2
N$21
  Top 0.254: IC7.4 23.5,55.37 19.56,55.37 18.67,54.48 R25.2
N$22
  Top 0.305: R20.1 LED6.A
N$23
  Top 0.254: IC2.12 26.43,68.24 LED7.C
N$24
  Top 0.254: IC1.14 36.34,44.31 35.43,45.21 PAD2.1
N$25
  Top 0.254: IC1.13 38.96,45.11 38.35,45.72 PAD3.1
N$27
  Top 0.305: LED6.C 91.95,27.43 94.61,30.1 94.61,32.14 ST1.1
N$29
  Top 0.254: IC2.11 22.77,68.74 22.35,68.33 LED8.C
N$31
  Top 0.254: IC2.7 13.2,70.74 12.06,71.88 8.38,71.88 7.87,71.37 7.87,70 X2.3
OIL_TEMP
  Top 0.406: R9.3 75.4,26.45 76.96,24.89 93.49,24.89 ST2.6
REED
  Top 0.305: IC1.35 52.81,38.73 55.24,38.73 56.77,37.21 56.77,31.24 61.85,26.16 63.75,26.16 68.58,21.34 83.82,21.34
  Top 0.406: ST2.5 93.54,21.34 83.82,21.34 82.04,23.11 LED5.C
RESET
  Top 0.254: IC1.4 48.59,53.01 45.09,56.52 45.09,58.29 | 45.09,58.29 45.09,65.41 46.1,66.42 47.62,66.42 48.14,66.42 50.29,66.42 52.07,64.64 JP2.2 | R24.1 44.96,58.17 45.09,58.29
RESETRR
  Top 0.254: IC2.20 33.52,60.84 34.92,59.44 34.92,59.43 R23.2
RX0
  Top 0.254: IC1.9 44.59,50.02 41.53,53.09 41.53,59.19 R7.2
RX0_R
  Top 0.254: R7.1 35.02,62.9 IC2.23
SCK
  Top 0.254: IC1.3 49.39,50.66 50.8,52.07 50.8,55.12 50.04,55.88 48.77,55.88 48.26,56.52 48.26,57.78 48.9,58.42 50.8,58.42 JP2.4
TX0
  Top 0.254: IC1.10 43.79,48.92 36.45,56.26 36.45,64.64 35.52,65.58 IC2.24
USBVCC  (1 unrouted)
  Top 0.254: 19.37,37.78 19.68,37.47 19.68,37.85 23.62,37.85 | 19.37,37.78 19.05,38.1 19.05,45.09 21.59,47.62 21.59,50.16 20.95,50.8 12.83,50.8 12.06,51.56 12.06,66.67 11.43,67.31 9.81,67.31 | 23.62,37.85 T5.5 23.62,35.81 24.64,35.81 24.64,36.62 T5.6 | 23.62,37.85 T5.2 23.62,40.01 24.57,40.01 T5.1 | 19.37,37.78 19.18,37.59 C14.1
VDD
  Top 0.254: 27.3,46.35 IC7.8 | 20.95,29.08 20.95,21.21 20.95,20.95 17.78,17.78 | 20.95,29.08 20.95,32.77 | 20.95,32.77 20.95,34.92 21.21,35.18 22.48,35.18 22.67,35.37 T5.4 | C4.1 IC1.17 | 30.48,54.86 32,54.86 32.77,54.1 32.77,48.51 | 12.45,68.58 6.1,68.58 5.46,69.22 5.46,71.63 13.08,79.76 24.51,79.76 | 24.51,79.76 30.86,79.76 | 30.86,79.76 40.77,79.76 | 40.77,79.76 46.74,79.76 49.02,77.47 49.02,71.12 | 49.02,71.12 49.02,69.6 50.29,68.33 53.85,68.33 56.52,65.66 56.52,63.5 | 56.52,63.5 56.52,51.56 49.4,44.45 | 56.52,63.5 56.39,63.37 R11.2 | 26.16,36.07 26.16,32.77 20.95,32.77 | IC2.14 30.52,64.17 27.56,61.21 | IC2.4 26.8,72.24 27.3,72.74 IC2.3 27.4,72.74 26.92,72.26 26.29,72.26 25.53,73.03 25.53,75.56 24.68,76.42 C15.2 24.55,77.22 24.51,77.22 | IC2.46 31.02,79.6 30.86,79.76 | IC2.31 48.9,71.24 49.02,71.12 | 40.77,79.76 40.77,78.74 38.86,76.83 33.4,76.83 33.02,76.45 IC2.42 | R14.1 25.78,61.59 26.16,61.21 | R15.1 22.29,62.04 22.1,61.85 22.1,61.21 | 12.57,68.58 13.34,67.82 13.34,66.29 arc90 14.1,65.53 17.91,65.53 arc-90 19.3,64.14 19.3,61.85 arc90 19.94,61.21 | 24.51,79.76 24.51,77.22 | 24.51,77.22 24.64,77.09 | 20.95,29.08 22.04,30.16 R1.1 | 27.36,48.26 32.38,48.26 32.64,48.51 32.77,48.51 | 32.77,48.51 32.77,43.05 33.91,41.91 35.94,41.91 | IC1.5 47.79,46.06 49.4,44.45 | 49.4,44.45 49.4,41.91 50.2,41.11 | 27.3,45.09 C17.2
  Top 0.305: 50.2,41.11 IC1.38 57.87,41.11 arc90 C7.1 | LED3.A 20.95,16.16 20.95,21.21 | 12.57,68.58 12.45,68.58 | 19.94,61.21 22.1,61.21 26.16,61.21 27.56,61.21 27.81,60.96 27.81,57.53 30.48,54.86 | 26.16,36.07 26.16,43.31 27.3,44.45 27.3,45.09 27.3,46.35 | IC7.8 27.36,48.26 | 35.43,41.91 35.94,41.91 C4.1 | 60.71,43.94 65.28,48.51 R22.1
  Top 0.406: IC4.1 4.45,24.77 3.81,24.13 3.81,19.05 5.08,17.78 7.62,17.78 | 7.62,17.78 15.24,17.78 | 15.24,17.78 17.78,17.78 | 7.62,17.78 C9.1 | 15.24,17.78 C11.2 | IC1.5 47.79,51.02 C5.1 | C7.1 60.71,43.94
VDD_R
  Top 0.254: R11.1 48.26,63.37 46.48,61.59 46.48,56.64 48.51,54.61 JP2.5

### Text on the board
Top: DZ | N | Blinker L | Blinker R | HB | MCc | OIL_T | Reed | KUP | GND | 12V | OIL_P | DZ | Aqua | UP | Oil | N | HB | OIL_P | BL | BL | DOWN